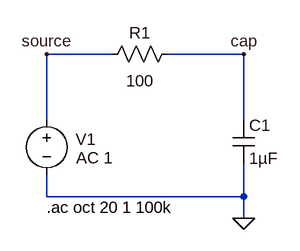
[diagram p0: schematic electronics_freq_sweep_into_cap.asc]
electronics_freq_sweep_into_cap.asc, the LTspice schematic file:
Version 4
SHEET 1 880 680
WIRE 128 16 32 16
WIRE 320 16 208 16
WIRE 32 112 32 16
WIRE 320 112 320 16
WIRE 32 224 32 192
WIRE 320 224 320 176
WIRE 320 224 32 224
WIRE 320 256 320 224
FLAG 320 256 0
FLAG 32 16 source
FLAG 320 16 cap
SYMBOL voltage 32 96 R0
WINDOW 123 24 124 Left 2
WINDOW 39 0 0 Left 0
WINDOW 0 42 44 Left 2
WINDOW 3 43 71 Left 2
SYMATTR InstName V1
SYMATTR Value AC 1
SYMBOL cap 304 112 R0
SYMATTR InstName C1
SYMATTR Value 1µF
SYMBOL res 112 32 R270
WINDOW 0 32 56 VTop 2
WINDOW 3 -7 56 VBottom 2
SYMATTR InstName R1
SYMATTR Value 100
TEXT 32 240 Left 2 !.ac oct 20 1 100k

The netlist it stands for:
* electronics_freq_sweep_into_cap.asc
V1 source 0 AC 1
C1 cap 0 1µF
R1 source cap 100
.ac oct 20 1 100k
.backanno
.end

* Results of the author's LTspice run, read from the files saved beside the schematic
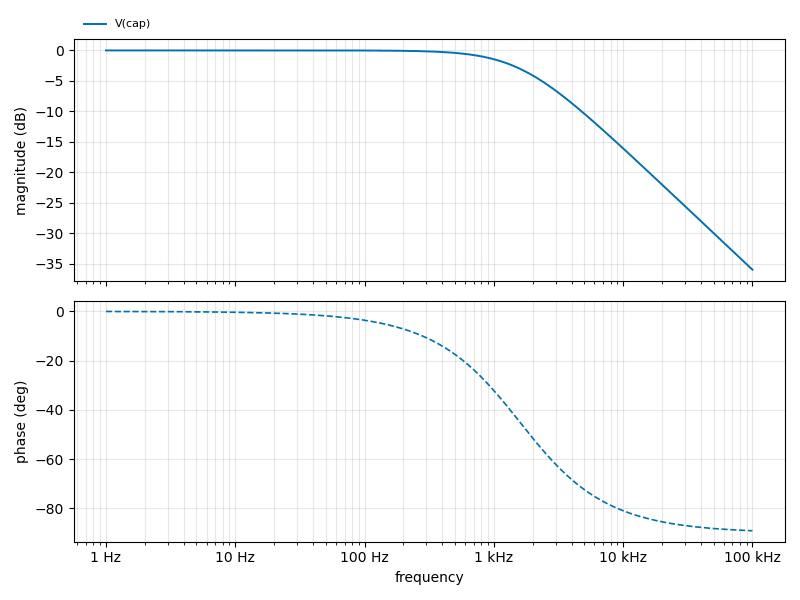
[diagram p1: AC Analysis of electronics_freq_sweep_into_cap.asc, plotted from the saved traces]
* AC Analysis, 1 run:
*   V(cap): -0.00 dB at 1 Hz, -35.96 dB at 100 kHz, peak -0.00 dB at 1 Hz, 3 dB below the peak at 1.591 kHz